# Altium schematic sheet Top_Sheet.SchDoc
size 420 x 297 mm; SheetNumber: 1; SheetTotal: 8
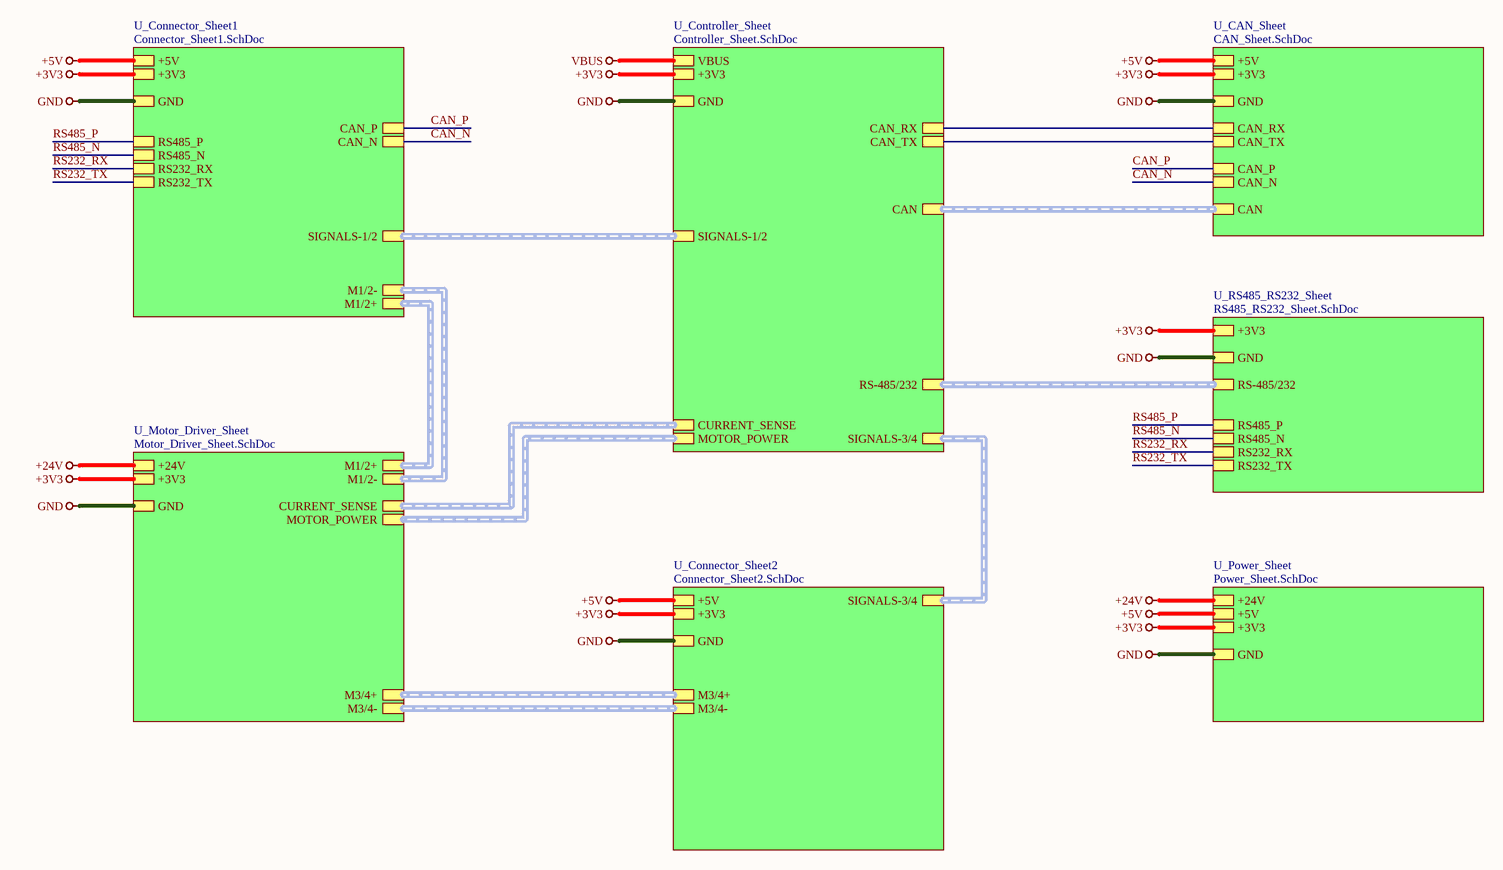
[diagram p0: Top_Sheet.SchDoc]

## Sub-sheets
U_CAN_Sheet = CAN_Sheet.SchDoc: CAN (harness CAN), CAN_RX, CAN_TX, CAN_P, CAN_N, +5V, +3V3, GND
U_Connector_Sheet1 = Connector_Sheet1.SchDoc: M1/2+ (harness M1/2+), M1/2- (harness M1/2-), CAN_P, CAN_N, RS485_N, RS485_P, RS232_RX, RS232_TX, SIGNALS-1/2 (harness SIGNALS-1/2), +5V, +3V3, GND
U_Connector_Sheet2 = Connector_Sheet2.SchDoc: M3/4+ (harness M3/4+), M3/4- (harness M3/4-), SIGNALS-3/4 (harness SIGNALS-3/4), +5V, +3V3, GND
U_Controller_Sheet = Controller_Sheet.SchDoc: CURRENT_SENSE (harness CURRENT_SENSE), MOTOR_POWER (harness MOTOR_POWER), CAN (harness CAN), CAN_RX, CAN_TX, RS-485/232 (harness RS-485/232), SIGNALS-3/4 (harness SIGNALS-3/4), SIGNALS-1/2 (harness SIGNALS-1/2), VBUS, +3V3, GND
U_Motor_Driver_Sheet = Motor_Driver_Sheet.SchDoc: M1/2+ (harness M1/2+), M3/4+ (harness M3/4+), M1/2- (harness M1/2-), M3/4- (harness M3/4-), CURRENT_SENSE (harness CURRENT_SENSE), MOTOR_POWER (harness MOTOR_POWER), +24V, +3V3, GND
U_Power_Sheet = Power_Sheet.SchDoc: +24V, +5V, +3V3, GND
U_RS485_RS232_Sheet = RS485_RS232_Sheet.SchDoc: RS485_N, RS485_P, RS232_RX, RS232_TX, RS-485/232 (harness RS-485/232), +3V3, GND

## Nets
+3V3: sheet U_CAN_Sheet/+3V3, sheet U_Connector_Sheet1/+3V3, sheet U_Connector_Sheet2/+3V3, sheet U_Controller_Sheet/+3V3, sheet U_Motor_Driver_Sheet/+3V3, sheet U_Power_Sheet/+3V3, sheet U_RS485_RS232_Sheet/+3V3
+5V: sheet U_CAN_Sheet/+5V, sheet U_Connector_Sheet1/+5V, sheet U_Connector_Sheet2/+5V, sheet U_Power_Sheet/+5V
+24V: sheet U_Motor_Driver_Sheet/+24V, sheet U_Power_Sheet/+24V
GND: sheet U_CAN_Sheet/GND, sheet U_Connector_Sheet1/GND, sheet U_Connector_Sheet2/GND, sheet U_Controller_Sheet/GND, sheet U_Motor_Driver_Sheet/GND, sheet U_Power_Sheet/GND, sheet U_RS485_RS232_Sheet/GND
VBUS: sheet U_Controller_Sheet/VBUS
CAN_N: sheet U_CAN_Sheet/CAN_N, sheet U_Connector_Sheet1/CAN_N
CAN_P: sheet U_CAN_Sheet/CAN_P, sheet U_Connector_Sheet1/CAN_P
RS232_RX: sheet U_Connector_Sheet1/RS232_RX, sheet U_RS485_RS232_Sheet/RS232_RX
RS232_TX: sheet U_Connector_Sheet1/RS232_TX, sheet U_RS485_RS232_Sheet/RS232_TX
RS485_N: sheet U_Connector_Sheet1/RS485_N, sheet U_RS485_RS232_Sheet/RS485_N
RS485_P: sheet U_Connector_Sheet1/RS485_P, sheet U_RS485_RS232_Sheet/RS485_P
(unnamed): sheet U_CAN_Sheet/CAN_RX, sheet U_Controller_Sheet/CAN_RX
(unnamed): sheet U_CAN_Sheet/CAN_TX, sheet U_Controller_Sheet/CAN_TX

## Buses and harness runs
harness sheet U_CAN_Sheet/CAN = sheet U_Controller_Sheet/CAN
harness sheet U_Connector_Sheet1/M1/2+ = sheet U_Motor_Driver_Sheet/M1/2+
harness sheet U_Connector_Sheet1/M1/2- = sheet U_Motor_Driver_Sheet/M1/2-
harness sheet U_Connector_Sheet1/SIGNALS-1/2 = sheet U_Controller_Sheet/SIGNALS-1/2
harness sheet U_Connector_Sheet2/M3/4+ = sheet U_Motor_Driver_Sheet/M3/4+
harness sheet U_Connector_Sheet2/M3/4- = sheet U_Motor_Driver_Sheet/M3/4-
harness sheet U_Connector_Sheet2/SIGNALS-3/4 = sheet U_Controller_Sheet/SIGNALS-3/4
harness sheet U_Controller_Sheet/CURRENT_SENSE = sheet U_Motor_Driver_Sheet/CURRENT_SENSE
harness sheet U_Controller_Sheet/MOTOR_POWER = sheet U_Motor_Driver_Sheet/MOTOR_POWER
harness sheet U_Controller_Sheet/RS-485/232 = sheet U_RS485_RS232_Sheet/RS-485/232

## Notes on the sheet
- File:
- Title:
- Date:
- Page
- Num:
- Total:
- Drawn By: Huzaifa Ali